# EAGLE board pge_pcb_v0_4 (EAGLE 9.5.2), part 1 of 2
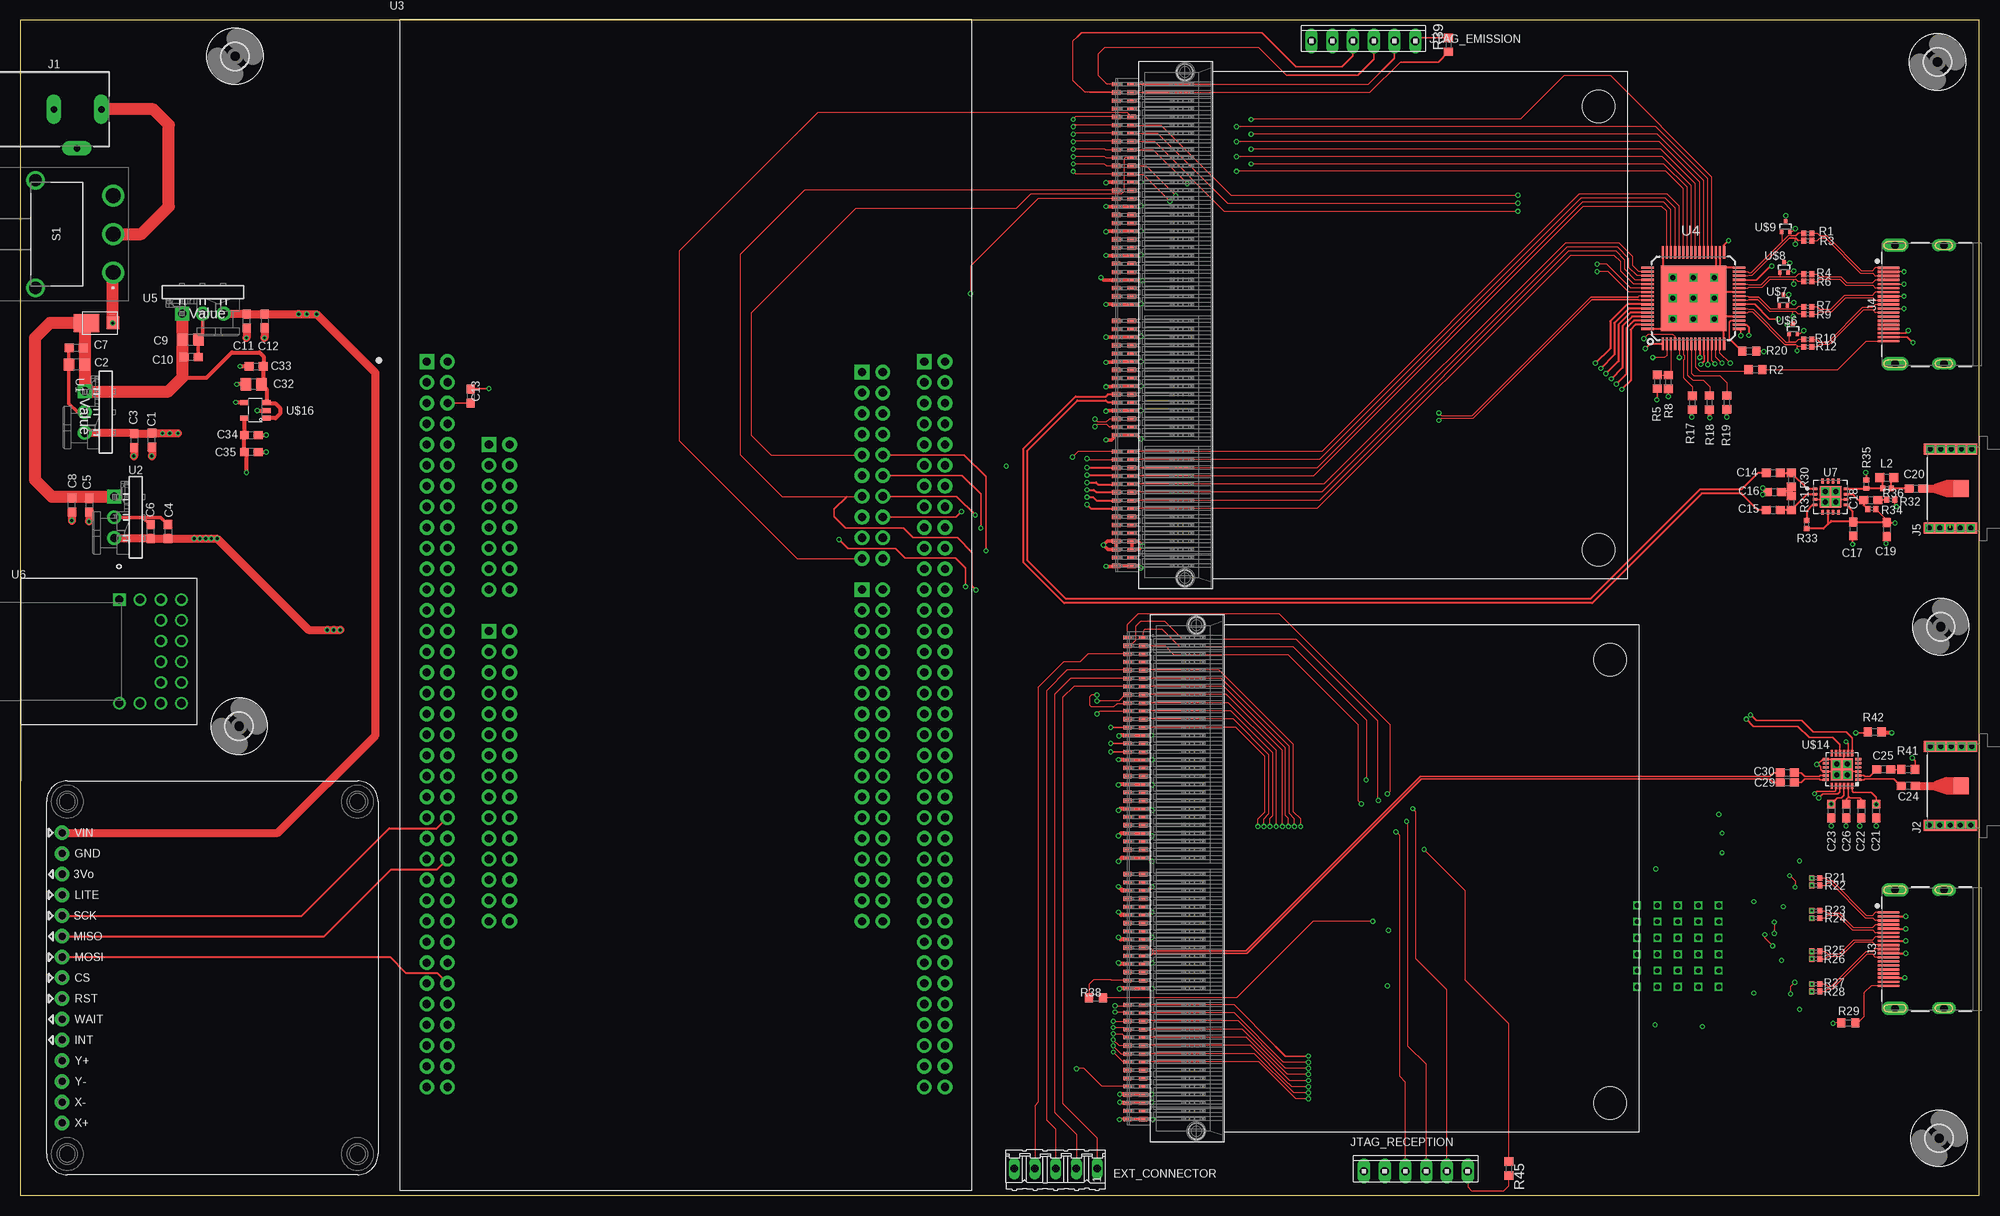
[diagram p3: board, top side]
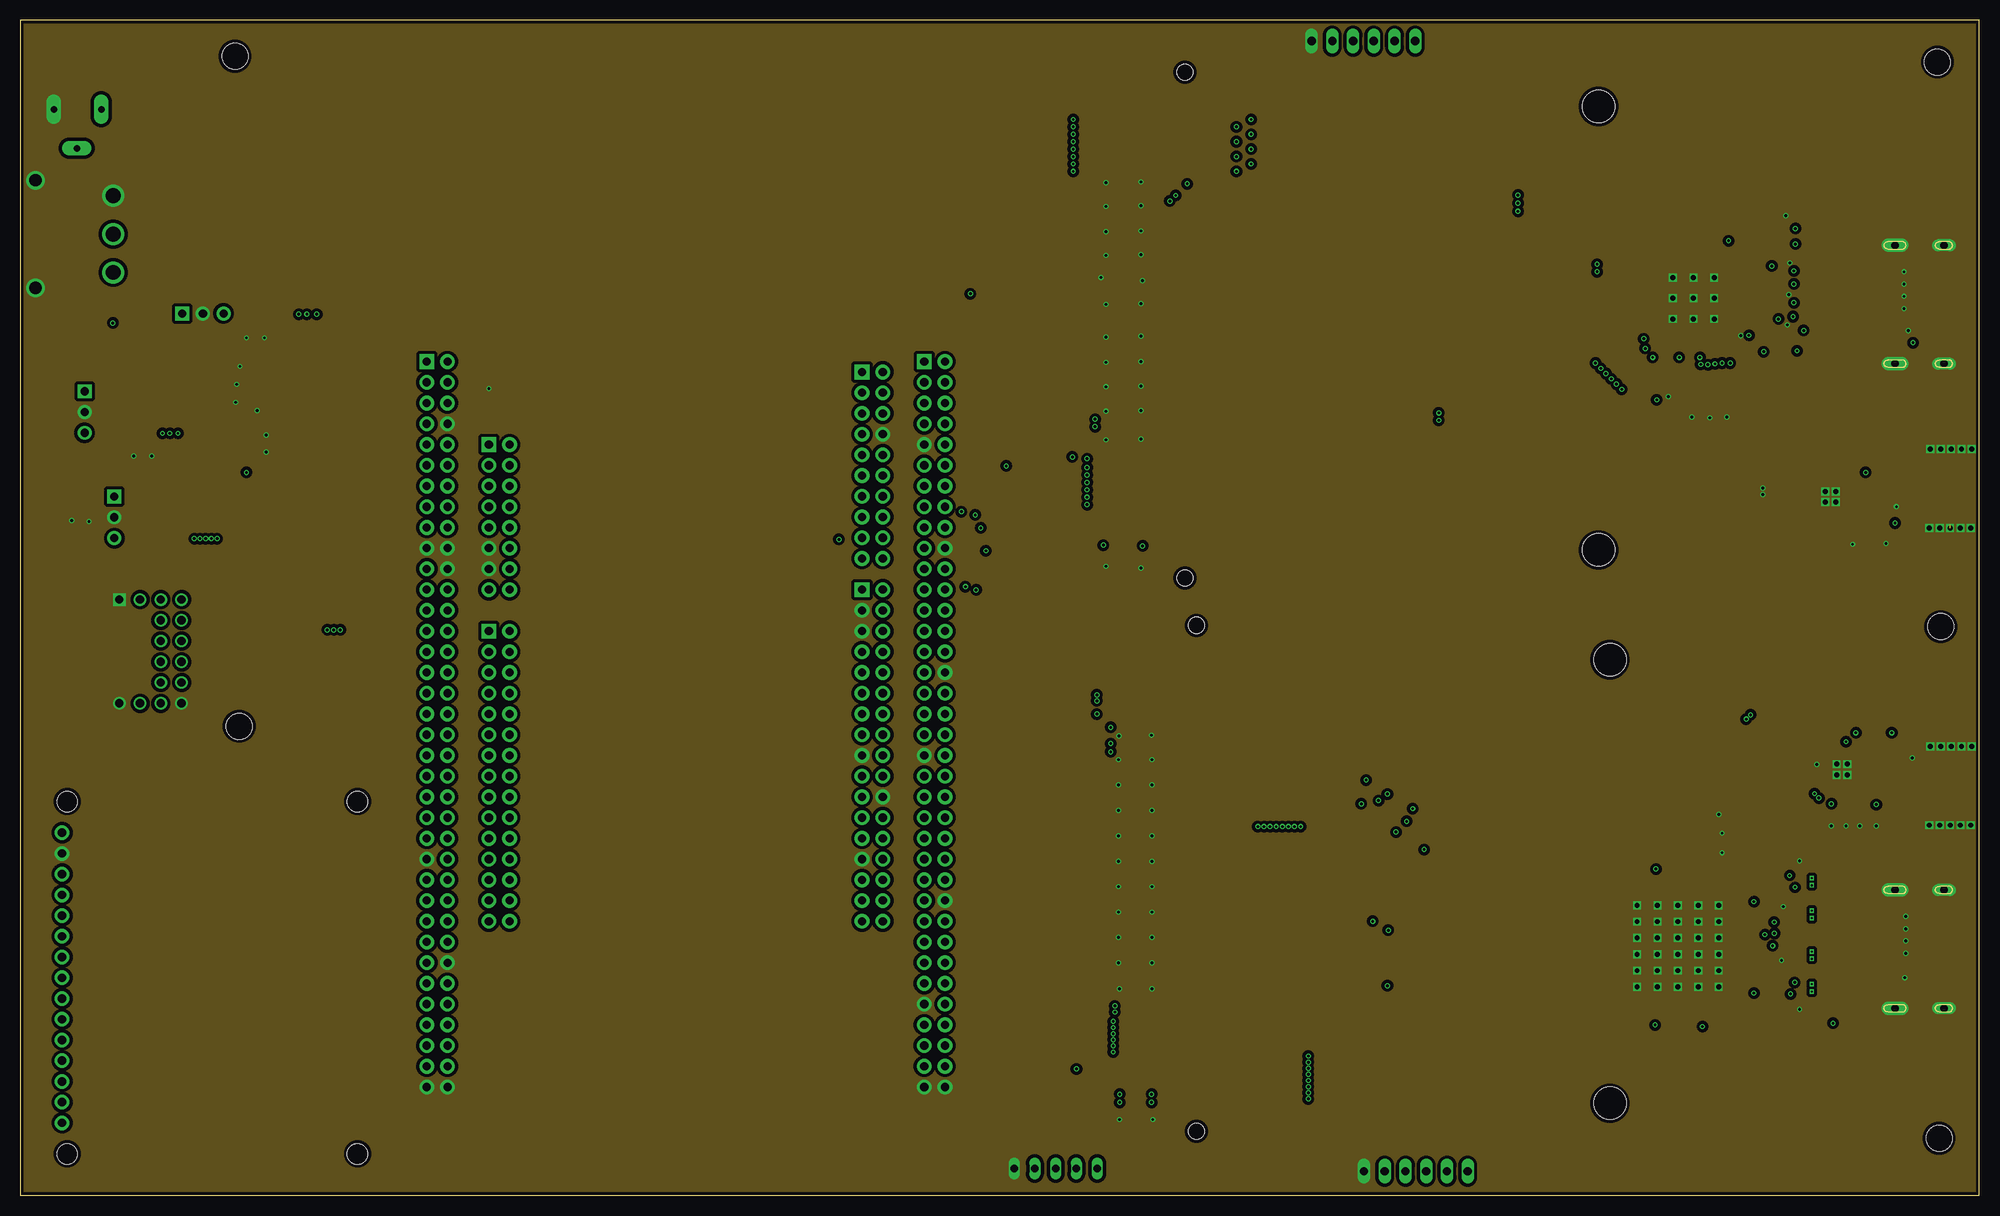
[diagram p4: board, inner layer Route2]
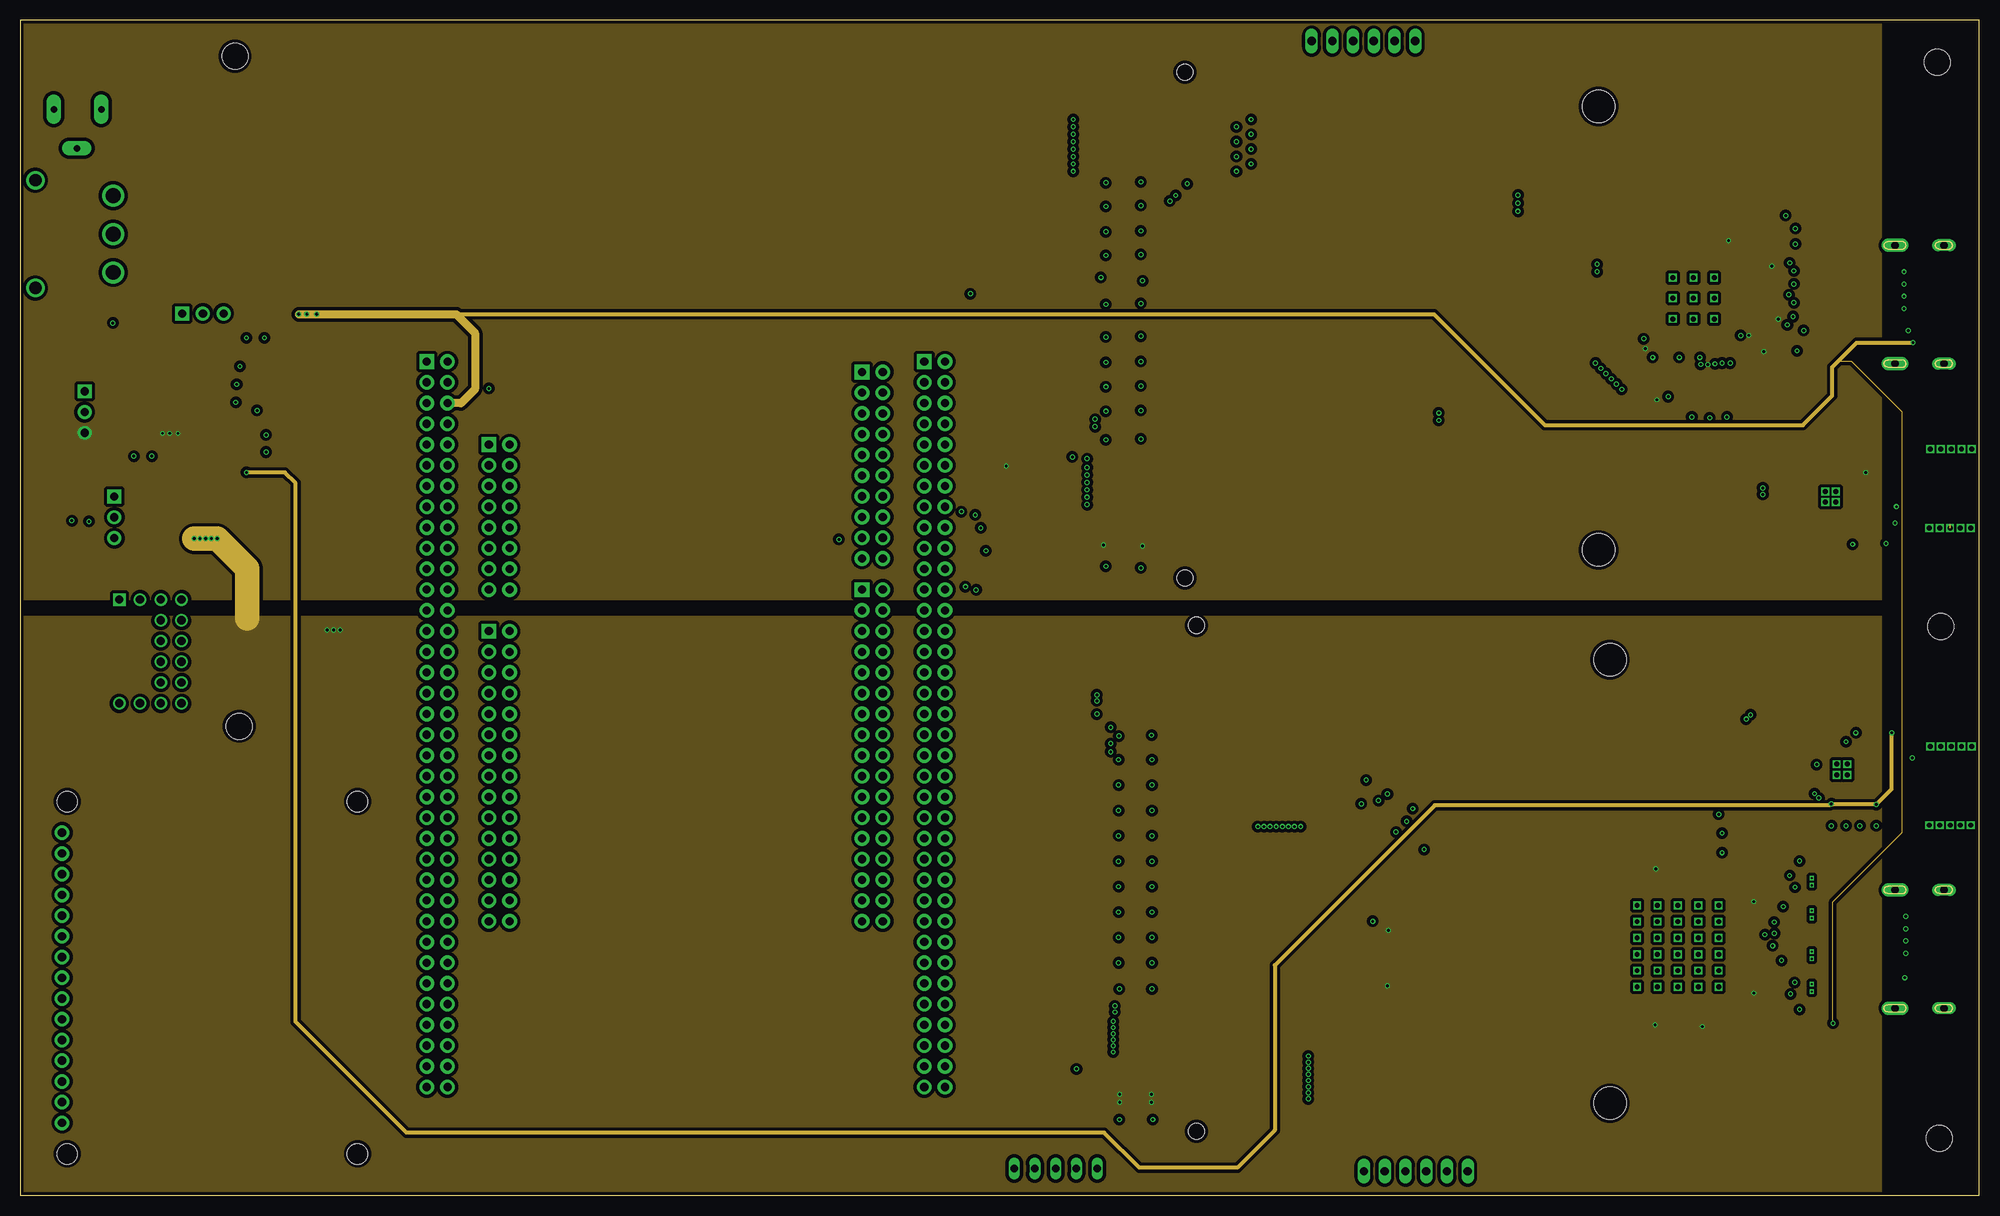
[diagram p5: board, inner layer Route3]
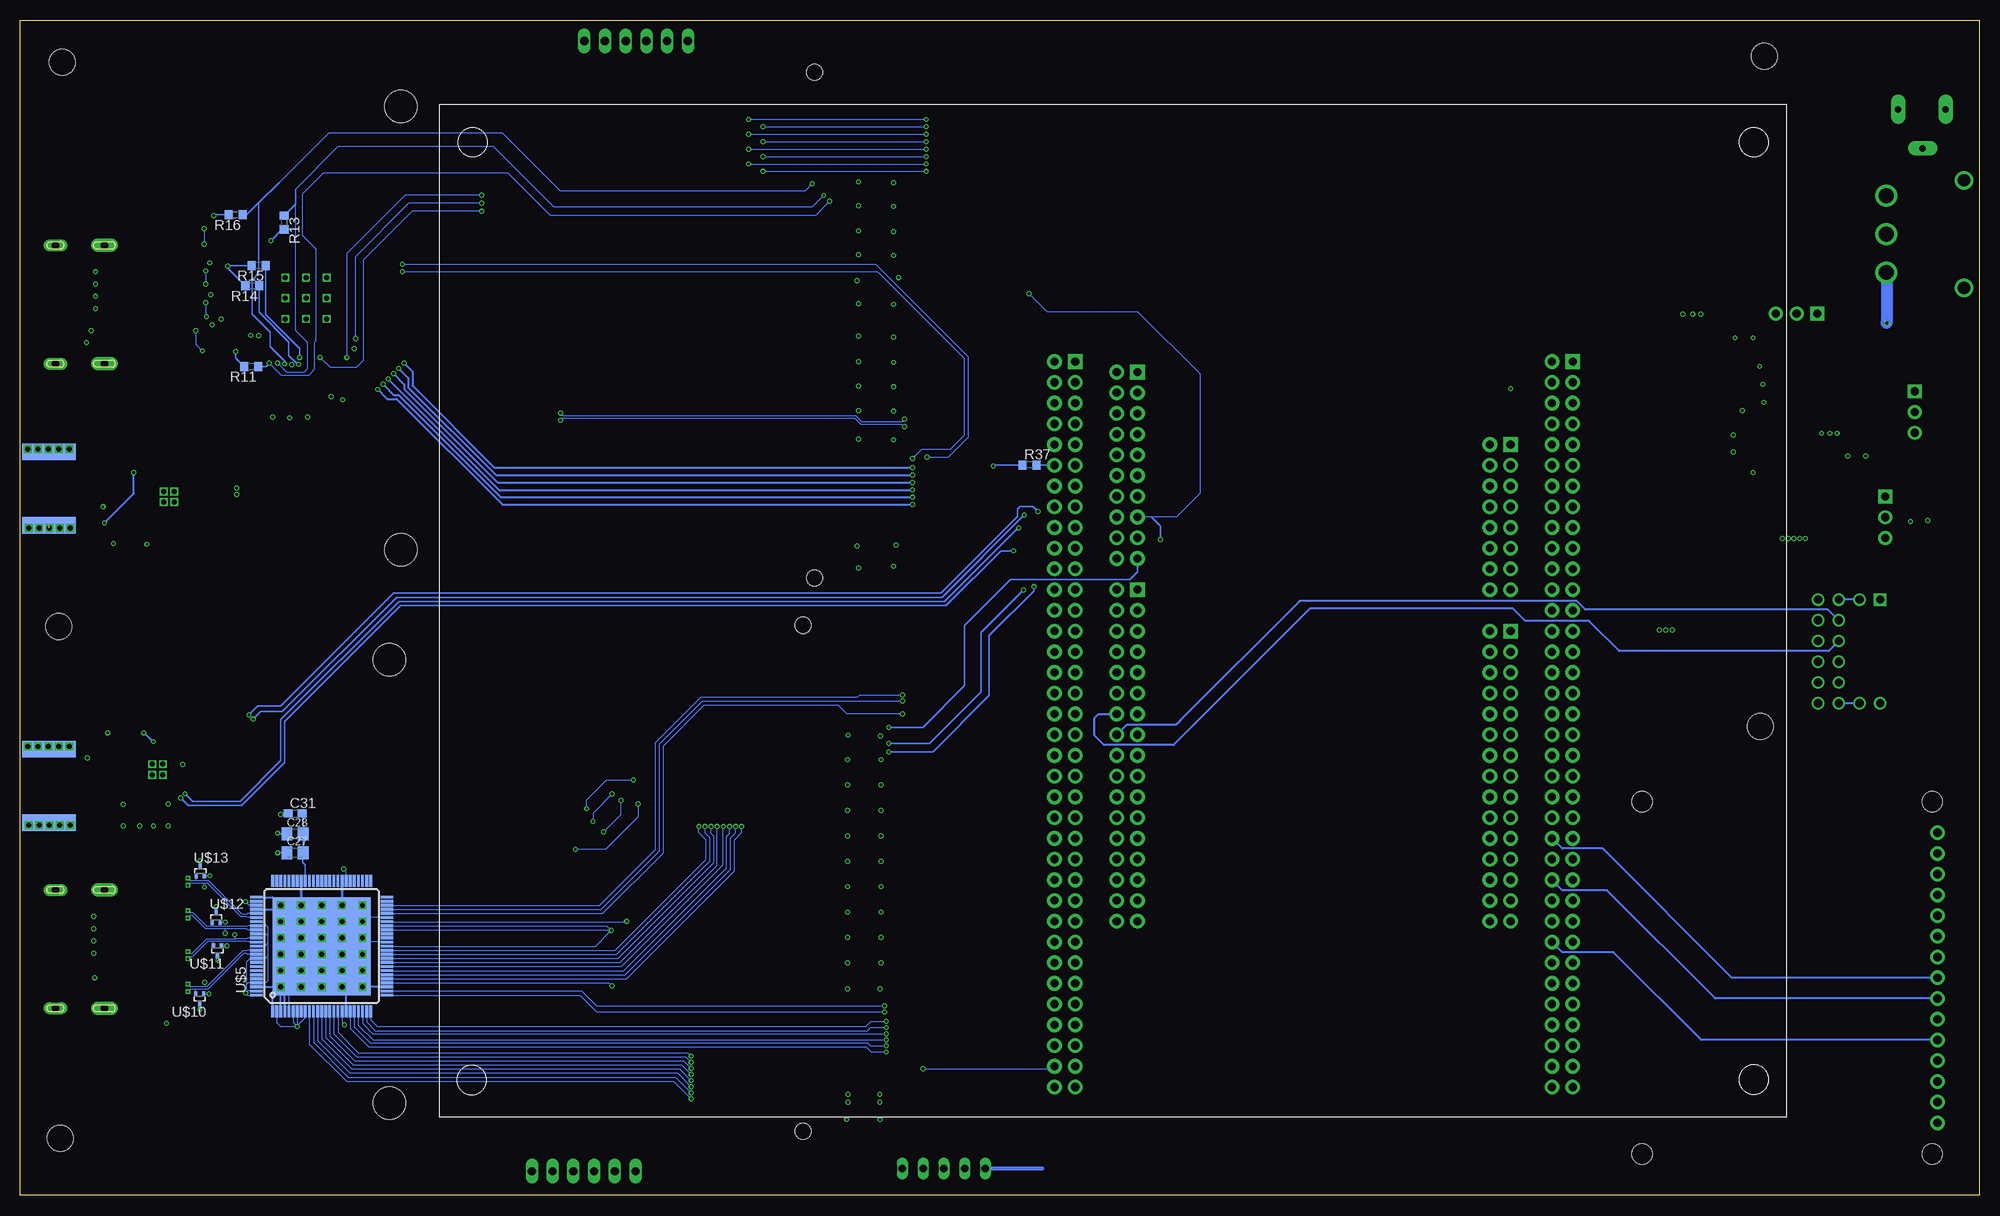
[diagram p6: board, bottom side, seen from below]

Size 240 x 144 mm. Coordinates in mm from the lower left corner, seen from the top.
Outline: 0,0 240,0 240,144 0,144 0,0
Copper layers (1+2*3+4*5+16): Top 0.018mm / dielectric 0.2mm / Route2 0.035mm / dielectric 0.36mm / Route3 0.035mm / dielectric 0.3mm / Route4 0.035mm / dielectric 0.36mm / Route5 0.035mm / dielectric 0.2mm / Bottom 0.018mm
Design rules "eC_6Layer_PClass6_BaseCopperO18-I35_eCDefault *": minimum track width 0.15mm, minimum drill 0.35mm, track to track 0.15mm, track to pad 0.15mm, pad to pad 0.1mm, via to via 0.1mm, smd to smd 0mil, copper to edge 0.25mm, drill to drill 0.35mm, minimum pad ring 0.175mm, minimum via ring 0.125mm, stop-mask expansion 0mil, vias tented up to drill 0.45mm, thermal gap 0.2mm
Net classes: 1 tmds1: width 0.15 mm, clearance 0.15 mm; 2 sdi: width 0.203 mm, clearance 0.254 mm

## Footprints (pad centres in the part's own frame; a part is rotated, then mirrored left to right if it is on the bottom)
C0603 = smd 1.1 x 1: 1 -0.85,0; 2 0.85,0
C0805 = smd 1.3 x 1.5: 1 -0.95,0; 2 0.95,0
C0805K = smd 1.3 x 1.6: 1 -1,0; 2 1,0
05P = drill 0.914 long: 1 -5.08,0; 2 -2.54,0; 3 0,0; 4 2.54,0; 5 5.08,0
3,2 = hole 3.2: 0,0
694106301002 = drill 0.8 pad 1.8 long: 1 5.8,0; 2 0,0; 3 2.8,-4.8
SAMTEC_BNC7T-J-P-XX-ST-EM1D = smd 1.98 x 1.83: 1 0,2.185 | drill 0.6 square: P$1 -4.826,6.096; P$2 -4.826,4.826; P$3 -4.826,3.556; P$4 -4.826,2.286; P$5 -4.826,1.016; P$6 4.826,0.889; P$7 4.826,2.159; P$8 4.826,3.429; P$9 4.826,4.699; P$10 4.826,5.969 | smd 1.35 x 6.55: S1 -4.825,3.525; S2 4.825,3.525 | smd 2 x 6.55 bottom: S3 -4.5,3.525; S4 4.5,3.525
685119134923 = smd 0.28 x 2.6: 1 4.5,0; 2 4,0; 3 3.5,0; 4 3,0; 5 2.5,0; 6 2,0; 7 1.5,0; 8 1,0; 9 0.5,0; 10 0,0; 11 -0.5,0; 12 -1,0; 13 -1.5,0; 14 -2,0; 15 -2.5,0; 16 -3,0; 17 -3.5,0; 18 -4,0; 19 -4.5,0 | drill 0.9 pad 1.65 long: SHELL -7.25,-0.8; SHELL1 7.25,-0.8 | drill 0.9 pad 1.5 long: SHELL2 -7.25,-6.8; SHELL3 7.25,-6.8
10X06MTA = drill 1.016 long: 1 6.35,0; 2 3.81,0; 3 1.27,0; 4 -1.27,0; 5 -3.81,0; 6 -6.35,0
L0603 = smd 1.1 x 1.1: 1 -0.85,0; 2 0.85,0
R0402 = smd 0.6 x 0.7: 1 -0.5,0; 2 0.5,0
R0603 = smd 1 x 1.1: 1 -0.85,0; 2 0.85,0
MS12ASW30U = drill 1.8 pad 2.7: 1 0,0; 2 -4.7,0; 3 -9.4,0 | drill 1.5 pad 2.25: MH1 1.9,-9.53; MH2 -11.3,-9.53
EAB0003A = drill 1.016 pad 1.702 square: 1 -2.54,0 | drill 1.016 pad 1.702: 2 0,0; 3 2.54,0
MODULE_NUCLEO-F429ZI = drill 1 pad 1.8 square: CN7_1 21.59,43.82; CN8_1 -24.13,34.93; CN9_1 -24.13,12.07; CN10_1 21.59,17.15; CN11_1 -31.75,45.09; CN12_1 29.21,45.09 | drill 1 pad 1.8: CN7_2 24.13,43.82; CN7_3 21.59,41.28; CN7_4 24.13,41.28; CN7_5 21.59,38.74; CN7_6 24.13,38.74; CN7_7 21.59,36.2; CN7_8 24.13,36.2; CN7_9 21.59,33.66; CN7_10 24.13,33.66; CN7_11 21.59,31.12; CN7_12 24.13,31.12; CN7_13 21.59,28.58; CN7_14 24.13,28.58; CN7_15 21.59,26.04; CN7_16 24.13,26.04; CN7_17 21.59,23.5; CN7_18 24.13,23.5; CN7_19 21.59,20.96; CN7_20 24.13,20.96; CN8_2 -21.59,34.93; CN8_3 -24.13,32.39; CN8_4 -21.59,32.39; CN8_5 -24.13,29.85; CN8_6 -21.59,29.85; CN8_7 -24.13,27.31; CN8_8 -21.59,27.31; CN8_9 -24.13,24.77; CN8_10 -21.59,24.77; CN8_11 -24.13,22.23; CN8_12 -21.59,22.23; CN8_13 -24.13,19.69; CN8_14 -21.59,19.69; CN8_15 -24.13,17.15; CN8_16 -21.59,17.15; CN9_2 -21.59,12.07; CN9_3 -24.13,9.53; CN9_4 -21.59,9.53; CN9_5 -24.13,6.99; CN9_6 -21.59,6.99; CN9_7 -24.13,4.45; CN9_8 -21.59,4.45; CN9_9 -24.13,1.91; CN9_10 -21.59,1.91; CN9_11 -24.13,-0.63; CN9_12 -21.59,-0.63; CN9_13 -24.13,-3.17; CN9_14 -21.59,-3.17; CN9_15 -24.13,-5.71; CN9_16 -21.59,-5.71; CN9_17 -24.13,-8.25; CN9_18 -21.59,-8.25; CN9_19 -24.13,-10.79; CN9_20 -21.59,-10.79; CN9_21 -24.13,-13.33; CN9_22 -21.59,-13.33; CN9_23 -24.13,-15.87; CN9_24 -21.59,-15.87; CN9_25 -24.13,-18.41; CN9_26 -21.59,-18.41; CN9_27 -24.13,-20.95; CN9_28 -21.59,-20.95; CN9_29 -24.13,-23.49; CN9_30 -21.59,-23.49; CN10_2 24.13,17.15; CN10_3 21.59,14.61; CN10_4 24.13,14.61; CN10_5 21.59,12.07; CN10_6 24.13,12.07; CN10_7 21.59,9.53; CN10_8 24.13,9.53; CN10_9 21.59,6.99; CN10_10 24.13,6.99; CN10_11 21.59,4.45; CN10_12 24.13,4.45; CN10_13 21.59,1.91; CN10_14 24.13,1.91; CN10_15 21.59,-0.63; CN10_16 24.13,-0.63; CN10_17 21.59,-3.17; CN10_18 24.13,-3.17; CN10_19 21.59,-5.71; CN10_20 24.13,-5.71; CN10_21 21.59,-8.25; CN10_22 24.13,-8.25; CN10_23 21.59,-10.79; CN10_24 24.13,-10.79; CN10_25 21.59,-13.33; CN10_26 24.13,-13.33; CN10_27 21.59,-15.87; CN10_28 24.13,-15.87; CN10_29 21.59,-18.41; CN10_30 24.13,-18.41; CN10_31 21.59,-20.95; CN10_32 24.13,-20.95; CN10_33 21.59,-23.49; CN10_34 24.13,-23.49; CN11_2 -29.21,45.09; CN11_3 -31.75,42.55; CN11_4 -29.21,42.55; CN11_5 -31.75,40.01; CN11_6 -29.21,40.01; CN11_7 -31.75,37.47; CN11_8 -29.21,37.47; CN11_9 -31.75,34.93; CN11_10 -29.21,34.93; CN11_11 -31.75,32.39; CN11_12 -29.21,32.39; CN11_13 -31.75,29.85; CN11_14 -29.21,29.85; CN11_15 -31.75,27.31; CN11_16 -29.21,27.31; CN11_17 -31.75,24.77; CN11_18 -29.21,24.77; CN11_19 -31.75,22.23; CN11_20 -29.21,22.23; CN11_21 -31.75,19.69; CN11_22 -29.21,19.69; CN11_23 -31.75,17.15; CN11_24 -29.21,17.15; CN11_25 -31.75,14.61; CN11_26 -29.21,14.61; CN11_27 -31.75,12.07; CN11_28 -29.21,12.07; CN11_29 -31.75,9.53; CN11_30 -29.21,9.53; CN11_31 -31.75,6.99; CN11_32 -29.21,6.99; CN11_33 -31.75,4.45; CN11_34 -29.21,4.45; CN11_35 -31.75,1.91; CN11_36 -29.21,1.91; CN11_37 -31.75,-0.63; CN11_38 -29.21,-0.63; CN11_39 -31.75,-3.17; CN11_40 -29.21,-3.17; CN11_41 -31.75,-5.71; CN11_42 -29.21,-5.71; CN11_43 -31.75,-8.25; CN11_44 -29.21,-8.25; CN11_45 -31.75,-10.79; CN11_46 -29.21,-10.79; CN11_47 -31.75,-13.33; CN11_48 -29.21,-13.33; CN11_49 -31.75,-15.87; CN11_50 -29.21,-15.87; CN11_51 -31.75,-18.41; CN11_52 -29.21,-18.41; CN11_53 -31.75,-20.95; CN11_54 -29.21,-20.95; CN11_55 -31.75,-23.49; CN11_56 -29.21,-23.49; CN11_57 -31.75,-26.03; CN11_58 -29.21,-26.03; CN11_59 -31.75,-28.57; CN11_60 -29.21,-28.57; CN11_61 -31.75,-31.11; CN11_62 -29.21,-31.11; CN11_63 -31.75,-33.65; CN11_64 -29.21,-33.65; CN11_65 -31.75,-36.19; CN11_66 -29.21,-36.19; CN11_67 -31.75,-38.73; CN11_68 -29.21,-38.73; CN11_69 -31.75,-41.27; CN11_70 -29.21,-41.27; CN11_71 -31.75,-43.81; CN11_72 -29.21,-43.81; CN12_2 31.75,45.09; CN12_3 29.21,42.55; CN12_4 31.75,42.55; CN12_5 29.21,40.01; CN12_6 31.75,40.01; CN12_7 29.21,37.47; CN12_8 31.75,37.47; CN12_9 29.21,34.93; CN12_10 31.75,34.93; CN12_11 29.21,32.39; CN12_12 31.75,32.39; CN12_13 29.21,29.85; CN12_14 31.75,29.85; CN12_15 29.21,27.31; CN12_16 31.75,27.31; CN12_17 29.21,24.77; CN12_18 31.75,24.77; CN12_19 29.21,22.23; CN12_20 31.75,22.23; CN12_21 29.21,19.69; CN12_22 31.75,19.69; CN12_23 29.21,17.15; CN12_24 31.75,17.15; CN12_25 29.21,14.61; CN12_26 31.75,14.61; CN12_27 29.21,12.07; CN12_28 31.75,12.07; CN12_29 29.21,9.53; CN12_30 31.75,9.53; CN12_31 29.21,6.99; CN12_32 31.75,6.99; CN12_33 29.21,4.45; CN12_34 31.75,4.45; CN12_35 29.21,1.91; CN12_36 31.75,1.91; CN12_37 29.21,-0.63; CN12_38 31.75,-0.63; CN12_39 29.21,-3.17; CN12_40 31.75,-3.17; CN12_41 29.21,-5.71; CN12_42 31.75,-5.71; CN12_43 29.21,-8.25; CN12_44 31.75,-8.25; CN12_45 29.21,-10.79; CN12_46 31.75,-10.79; CN12_47 29.21,-13.33; CN12_48 31.75,-13.33; CN12_49 29.21,-15.87; CN12_50 31.75,-15.87; CN12_51 29.21,-18.41; CN12_52 31.75,-18.41; CN12_53 29.21,-20.95; CN12_54 31.75,-20.95; CN12_55 29.21,-23.49; CN12_56 31.75,-23.49; CN12_57 29.21,-26.03; CN12_58 31.75,-26.03; CN12_59 29.21,-28.57; CN12_60 31.75,-28.57; CN12_61 29.21,-31.11; CN12_62 31.75,-31.11; CN12_63 29.21,-33.65; CN12_64 31.75,-33.65; CN12_65 29.21,-36.19; CN12_66 31.75,-36.19; CN12_67 29.21,-38.73; CN12_68 31.75,-38.73; CN12_69 29.21,-41.27; CN12_70 31.75,-41.27; CN12_71 29.21,-43.81; CN12_72 31.75,-43.81
PQFP-64 = smd 1.55 x 0.25: 1 -5.6,3.75; 2 -5.6,3.25; 3 -5.6,2.75; 4 -5.6,2.25; 5 -5.6,1.75; 6 -5.6,1.25; 7 -5.6,0.75; 8 -5.6,0.25; 9 -5.6,-0.25; 10 -5.6,-0.75; 11 -5.6,-1.25; 12 -5.6,-1.75; 13 -5.6,-2.25; 14 -5.6,-2.75; 15 -5.6,-3.25; 16 -5.6,-3.75; 33 5.6,-3.75; 34 5.6,-3.25; 35 5.6,-2.75; 36 5.6,-2.25; 37 5.6,-1.75; 38 5.6,-1.25; 39 5.6,-0.75; 40 5.6,-0.25; 41 5.6,0.25; 42 5.6,0.75; 43 5.6,1.25; 44 5.6,1.75; 45 5.6,2.25; 46 5.6,2.75; 47 5.6,3.25; 48 5.6,3.75 | smd 0.25 x 1.55: 17 -3.75,-5.6; 18 -3.25,-5.6; 19 -2.75,-5.6; 20 -2.25,-5.6; 21 -1.75,-5.6; 22 -1.25,-5.6; 23 -0.75,-5.6; 24 -0.25,-5.6; 25 0.25,-5.6; 26 0.75,-5.6; 27 1.25,-5.6; 28 1.75,-5.6; 29 2.25,-5.6; 30 2.75,-5.6; 31 3.25,-5.6; 32 3.75,-5.6; 49 3.75,5.6; 50 3.25,5.6; 51 2.75,5.6; 52 2.25,5.6; 53 1.75,5.6; 54 1.25,5.6; 55 0.75,5.6; 56 0.25,5.6; 57 -0.25,5.6; 58 -0.75,5.6; 59 -1.25,5.6; 60 -1.75,5.6; 61 -2.25,5.6; 62 -2.75,5.6; 63 -3.25,5.6; 64 -3.75,5.6 | smd 8 x 8: EP 0,0 | drill 0.6 square: P$1 -2.54,2.54; P$2 0,2.54; P$3 2.54,2.54; P$4 -2.54,0; P$5 0,0; P$6 2.54,0; P$7 -2.54,-2.54; P$8 0,-2.54; P$9 2.54,-2.54
FTDI_MM232R = drill 1.01 square: 1 1.25,6.35 | drill 1.01: 2 3.79,6.35; 3 6.33,6.35; 4 8.87,6.35; 5 6.33,3.81; 6 8.87,3.81; 7 6.33,1.27; 8 8.87,1.27; 9 8.87,-1.27; 10 6.33,-1.27; 11 8.87,-3.81; 12 6.33,-3.81; 13 8.87,-6.35; 14 6.33,-6.35; 15 3.79,-6.35; 16 1.25,-6.35
TEXAS_INSTRUMENTS_LMH0302SQE-NOPB_0 = smd 0.6 x 0.3: 1 -1.9,0.975; 2 -1.9,0.325; 3 -1.9,-0.325; 4 -1.9,-0.975; 9 1.9,-0.975; 10 1.9,-0.325; 11 1.9,0.325; 12 1.9,0.975 | smd 0.3 x 0.6: 5 -0.975,-1.9; 6 -0.325,-1.9; 7 0.325,-1.9; 8 0.975,-1.9; 13 0.975,1.9; 14 0.325,1.9; 15 -0.325,1.9; 16 -0.975,1.9 | smd 2.6 x 2.6: 17 0,0 | drill 0.6 square: P$1 -0.635,0.635; P$2 0.635,0.635; P$3 -0.635,-0.635; P$4 0.635,-0.635
DO-221BC(SMPA) = smd 3.1 x 2.2: P$1 -1.61,0 | smd 1.5 x 1.52: P$2 1.61,0
MEC1-160-02-L-D-RA1-SL = smd 0.508 x 1.016: 1 0,0; 2 0,1.922; 3 1,0; 4 1,1.922; 5 2,0; 6 2,1.922; 7 3,0; 8 3,1.922; 9 4,0; 10 4,1.922; 11 5,0; 12 5,1.922; 13 6,0; 14 6,1.922; 15 7,0; 16 7,1.922; 17 8,0; 18 8,1.922; 19 9,0; 20 9,1.922; 21 10,0; 22 10,1.922; 23 11,0; 24 11,1.922; 25 12,0; 26 12,1.922; 27 13,0; 28 13,1.922; 29 14,0; 30 14,1.922; 31 16,0; 32 16,1.922; 33 17,0; 34 17,1.922; 35 18,0; 36 18,1.922; 37 19,0; 38 19,1.922; 39 20,0; 40 20,1.922; 41 21,0; 42 21,1.922; 43 22,0; 44 22,1.922; 45 23,0; 46 23,1.922; 47 24,0; 48 24,1.922; 49 25,0; 50 25,1.922; 51 26,0; 52 26,1.922; 53 27,0; 54 27,1.922; 55 28,0; 56 28,1.922; 57 29,0; 58 29,1.922; 59 30,0; 60 30,1.922; 61 32,0; 62 32,1.922; 63 33,0; 64 33,1.922; 65 34,0; 66 34,1.922; 67 35,0; 68 35,1.922; 69 36,0; 70 36,1.922; 71 37,0; 72 37,1.922; 73 38,0; 74 38,1.922; 75 39,0; 76 39,1.922; 77 40,0; 78 40,1.922; 79 41,0; 80 41,1.922; 81 42,0; 82 42,1.922; 83 43,0; 84 43,1.922; 85 44,0; 86 44,1.922; 87 45,0; 88 45,1.922; 89 46,0; 90 46,1.922; 91 47,0; 92 47,1.922; 93 48,0; 94 48,1.922; 95 49,0; 96 49,1.922; 97 50,0; 98 50,1.922; 99 51,0; 100 51,1.922; 101 52,0; 102 52,1.922; 103 53,0; 104 53,1.922; 105 54,0; 106 54,1.922; 107 55,0; 108 55,1.922; 109 56,0; 110 56,1.922; 111 57,0; 112 57,1.922; 113 58,0; 114 58,1.922; 115 59,0; 116 59,1.922 | hole 2: -1.501,-6.515; 60.498,-6.515 | hole 4: 1.931,-57.185; 56.276,-57.185
PQFP100 = smd 1.5 x 0.35: 1 -8,6; 2 -8,5.5; 3 -8,5; 4 -8,4.5; 5 -8,4; 6 -8,3.5; 7 -8,3; 8 -8,2.5; 9 -8,2; 10 -8,1.5; 11 -8,1; 12 -8,0.5; 13 -8,0; 14 -8,-0.5; 15 -8,-1; 16 -8,-1.5; 17 -8,-2; 18 -8,-2.5; 19 -8,-3; 20 -8,-3.5; 21 -8,-4; 22 -8,-4.5; 23 -8,-5; 24 -8,-5.5; 25 -8,-6; 51 8,-6; 52 8,-5.5; 53 8,-5; 54 8,-4.5; 55 8,-4; 56 8,-3.5; 57 8,-3; 58 8,-2.5; 59 8,-2; 60 8,-1.5; 61 8,-1; 62 8,-0.5; 63 8,0; 64 8,0.5; 65 8,1; 66 8,1.5; 67 8,2; 68 8,2.5; 69 8,3; 70 8,3.5; 71 8,4; 72 8,4.5; 73 8,5; 74 8,5.5; 75 8,6 | smd 0.35 x 1.5: 26 -6,-8; 27 -5.5,-8; 28 -5,-8; 29 -4.5,-8; 30 -4,-8; 31 -3.5,-8; 32 -3,-8; 33 -2.5,-8; 34 -2,-8; 35 -1.5,-8; 36 -1,-8; 37 -0.5,-8; 38 0,-8; 39 0.5,-8; 40 1,-8; 41 1.5,-8; 42 2,-8; 43 2.5,-8; 44 3,-8; 45 3.5,-8; 46 4,-8; 47 4.5,-8; 48 5,-8; 49 5.5,-8; 50 6,-8; 76 6,8; 77 5.5,8; 78 5,8; 79 4.5,8; 80 4,8; 81 3.5,8; 82 3,8; 83 2.5,8; 84 2,8; 85 1.5,8; 86 1,8; 87 0.5,8; 88 0,8; 89 -0.5,8; 90 -1,8; 91 -1.5,8; 92 -2,8; 93 -2.5,8; 94 -3,8; 95 -3.5,8; 96 -4,8; 97 -4.5,8; 98 -5,8; 99 -5.5,8; 100 -6,8 | smd 12 x 12: P$1 0,0 | drill 0.6 square: P$2 -5,5; P$3 -3,5; P$4 -1,5; P$5 1,5; P$6 3,5; P$7 5,5; P$14 -5,-5; P$15 -3,-5; P$16 -1,-5; P$17 1,-5; P$18 3,-5; P$19 5,-5; P$20 -5,0; P$21 -3,0; P$22 -1,0; P$23 1,0; P$24 3,0; P$25 5,0; P$26 -5,2.5; P$27 -3,2.5; P$28 -1,2.5; P$29 1,2.5; P$30 3,2.5; P$31 5,2.5; P$32 -5,-2.5; P$33 -3,-2.5; P$34 -1,-2.5; P$35 1,-2.5; P$36 3,-2.5; P$37 5,-2.5
SC75_INFINEON = smd 0.4 x 0.65: 1 -0.5,-0.575; 2 0.5,-0.575; 3 0,0.575
QFN24-4X4 = smd 0.75 x 0.3: 1 -2,1.25; 2 -2,0.75; 3 -2,0.25; 4 -2,-0.25; 5 -2,-0.75; 6 -2,-1.25; 13 2,-1.25; 14 2,-0.75; 15 2,-0.25; 16 2,0.25; 17 2,0.75; 18 2,1.25 | smd 0.3 x 0.75: 7 -1.25,-2; 8 -0.75,-2; 9 -0.25,-2; 10 0.25,-2; 11 0.75,-2; 12 1.25,-2; 19 1.25,2; 20 0.75,2; 21 0.25,2; 22 -0.25,2; 23 -0.75,2; 24 -1.25,2 | smd 2.7 x 2.7: EXP 0,0 | drill 0.6 square: P$1 -0.66,0.66; P$2 0.66,0.66; P$3 -0.66,-0.66; P$4 0.66,-0.66
RA88758_BOARD = drill 1.016 pad 1.778: 3V0 11.43,1.905; CS 24.13,1.905; GND 8.89,1.905; INT 31.75,1.905; LITE 13.97,1.905; MISO 19.05,1.905; MOSI 21.59,1.905; RST 26.67,1.905; SCK 16.51,1.905; VIN 6.35,1.905; WATT 29.21,1.905; X+ 41.91,1.905; X- 39.37,1.905; Y+ 34.29,1.905; Y- 36.83,1.905 | hole 2.5: 2.54,2.54; 45.72,2.54; 2.54,38.1; 45.72,38.1
SOT23-5 = smd 0.6 x 1.05: 1 -0.95,-1.35; 2 0,-1.35; 3 0.95,-1.35; 4 0.95,1.35; 5 -0.95,1.35

## Placement (x,y rotation side)
C1  100nF  [C0603]  16.12,92.57 90 top
C2  10uF  [C0805]  6.88,101.83 180 top
C3  10uF  [C0603]  13.93,92.53 270 top
C4  100nF  [C0603]  18.08,81.35 270 top
C5  10uF  [C0603]  8.43,84.58 270 top
C6  10uF  [C0603]  15.97,81.37 90 top
C7  100nF  [C0603]  6.83,103.88 0 top
C8  100nF  [C0603]  6.32,84.61 90 top
C9  10uF  [C0805]  20.87,104.87 0 top
C10  100nF  [C0603]  20.91,102.72 180 top
C11  100nF  [C0603]  27.72,107.17 90 top
C12  10uF  [C0603]  29.93,107.18 270 top
C13  100nF  [C0603]  55.18,97.95 270 top
C14  1uF  [C0603]  214.8,88.55 0 top
C15  1uF  [C0603]  214.8,84 0 top
C16  100nF  [C0603]  214.93,86.18 0 top
C17  100nF  [C0603]  224.58,81.69 270 top
C18  4.7uF  [C0603]  226.72,85.23 0 top
C19  100nF  [C0603]  228.68,81.61 270 top
C20  4.7uF  [C0603]  232.27,86.63 0 top
C21  100nF  [C0603]  227.4,47.1 90 top
C22  100nF  [C0603]  225.57,47.1 270 top
C23  100nF  [C0603]  221.9,47.1 270 top
C24  4.7uF  [C0603]  231.3,50.2 180 top
C25  4.7uF  [C0603]  228.3,52.2 180 top
C26  1uF  [C0603]  223.73,47.1 270 top
C27  22uF  [C0805K]  206.35,42 0 bottom
C28  22uF  [C0805K]  206.35,44.3 0 bottom
C29  4.7uF  [C0603]  216.5,50.6 180 top
C30  4.7uF  [C0603]  216.5,51.8 0 top
C31  100nF  [C0603]  206.35,46.8 0 bottom
C32  10uF  [C0805]  28.6,99.4 180 top
C33  100nF  [C0603]  28.9,101.6 0 top
C34  10uF  [C0603]  28.3,93.2 0 top
C35  100nF  [C0603]  28.3,91.1 180 top
EXT_CONNECTOR  [05P]  126.85,3.3 180 top
H1  MOUNT-HOLE3.2  [3,2]  234.9,138.9 0 top
H2  MOUNT-HOLE3.2  [3,2]  235.3,69.7 0 top
H3  MOUNT-HOLE3.2  [3,2]  235.1,7 0 top
H6  MOUNT-HOLE3.2  [3,2]  26.3,139.6 0 top
H7  MOUNT-HOLE3.2  [3,2]  26.8,57.5 0 top
J1  [694106301002]  4.11,133.11 0 top
J2  BNC7T-J-P-XX-ST-EM1D  [SAMTEC_BNC7T-J-P-XX-ST-EM1D]  240,50.2 90 top
J3  [685119134923]  228.9,30.19 90 top
J4  [685119134923]  228.9,109.19 90 top
J5  BNC7T-J-P-XX-ST-EM1D  [SAMTEC_BNC7T-J-P-XX-ST-EM1D]  240,86.63 90 top
JTAG_EMISSION  [10X06MTA]  164.56,141.47 0 top
JTAG_RECEPTION  [10X06MTA]  170.98,2.97 0 top
L2  6.8nH  [L0603]  228.7,87.95 0 top
R1  28R  [R0402]  219,117.9 0 top
R2  1k  [R0603]  212.6,101.21 0 top
R3  28R  [R0402]  219,117 0 top
R4  28R  [R0402]  219,112.9 0 top
R5  2.43K  [R0603]  200.58,99.71 270 top
R6  28R  [R0402]  219,112 0 top
R7  28R  [R0402]  219,108.9 0 top
R8  909 R  [R0603]  201.92,99.69 90 top
R9  28R  [R0402]  219,108 0 top
R10  28R  [R0402]  219,104.9 0 top
R11  5k  [R0603]  211.71,101.59 180 bottom
R12  28R  [R0402]  219,104 0 top
R13  5k  [R0603]  207.67,119.24 270 bottom
R14  5k  [R0603]  211.58,111.47 180 bottom
R15  5k  [R0603]  210.8,113.97 180 bottom
R16  5k  [R0603]  213.62,120.17 180 bottom
R17  0R  [R0603]  204.87,97.14 90 top
R18  0R  [R0603]  206.97,97.16 90 top
R19  0R  [R0603]  209.07,97.18 90 top
R20  499 R  [R0603]  211.84,103.48 0 top
R21  28R  [R0402]  220,38.9 0 top
R22  28R  [R0402]  220,38 0 top
R23  28R  [R0402]  220,34.9 0 top
R24  28R  [R0402]  220,34 0 top
R25  28R  [R0402]  220,29.9 0 top
R26  28R  [R0402]  220,29 0 top
R27  28R  [R0402]  220,25.9 0 top
R28  28R  [R0402]  220,25 0 top
R29  1k  [R0603]  223.96,21.13 0 top
R30  50R  [R0603]  217,87.7 270 top
R31  50R  [R0603]  217,84.85 270 top
R32  75R  [R0402]  229.18,85.27 0 top
R33  750R  [R0402]  218.87,82.22 270 top
R34  75R  [R0402]  226.84,84.13 0 top
R35  75R  [R0402]  226.17,87.16 90 top
R36  75R  [R0402]  228.72,86.67 180 top
R37  1.5k  [R0603]  116.36,89.53 0 bottom
R38  22R  [R0603]  131.79,24.21 0 top
R39  22R  [R0603]  175,141 90 top
R41  75R  [R0603]  231.3,52.2 180 top
R42  1k  [R0603]  227.2,56.8 180 top
R45  22R  [R0603]  182.4,3.3 270 top
S1  MS12ASW30_U  [MS12ASW30U]  11.37,113.11 270 top
U1  Value  [EAB0003A]  7.87,96 270 top
U2  Value  [EAB0003A]  11.5,83.1 270 top
U3  NUCLEO-F429ZI  [MODULE_NUCLEO-F429ZI]  81.54,57.09 0 top
U4  TFP410  [PQFP-64]  205,109.95 90 top
U5  Value  [EAB0003A]  22.36,108.07 0 top
U6  MM232R  [FTDI_MM232R]  10.87,66.67 0 top
U7  TEXAS_INSTRUMENTS_LMH0302SQE-NOPBTEXAS_INSTRUMENTS_LMH0302SQE-NOPB_0_0  [TEXAS_INSTRUMENTS_LMH0302SQE-NOPB_0]  221.8,85.62 0 top
U$1  V8PAL45HM3_A/I  [DO-221BC(SMPA)]  9.72,106.91 0 top
U$2  MEC1-160-02-L-D-RA1-SL  [MEC1-160-02-L-D-RA1-SL]  137.58,9.37 90 top
U$3  7INCHHDMILCD(C)  [7INCHHDMILCD(C)]  27.61,14.18 180 bottom
U$4  MEC1-160-02-L-D-RA1-SL  [MEC1-160-02-L-D-RA1-SL]  136.18,77.17 90 top
U$5  TFP403  [PQFP100]  203.09,30.55 90 bottom
U$6  RCLAMP0502B  [SC75_INFINEON]  217.21,106.18 0 top
U$7  RCLAMP0502B  [SC75_INFINEON]  216.01,109.73 0 top
U$8  RCLAMP0502B  [SC75_INFINEON]  216.09,113.73 0 top
U$9  RCLAMP0502B  [SC75_INFINEON]  216.3,118.73 0 top
U$10  RCLAMP0502B  [SC75_INFINEON]  218.03,24.12 180 bottom
U$11  RCLAMP0502B  [SC75_INFINEON]  215.86,30.02 180 bottom
U$12  RCLAMP0502B  [SC75_INFINEON]  216.01,34.08 0 bottom
U$13  RCLAMP0502B  [SC75_INFINEON]  217.96,39.74 0 bottom
U$14  LMH0324  [QFN24-4X4]  223.2,52.2 180 top
U$15  RA8875_BOARD  [RA88758_BOARD]  3.2,50.8 270 top
U$16  NCP718ASN250T1G  [SOT23-5]  28.8,96.2 90 top